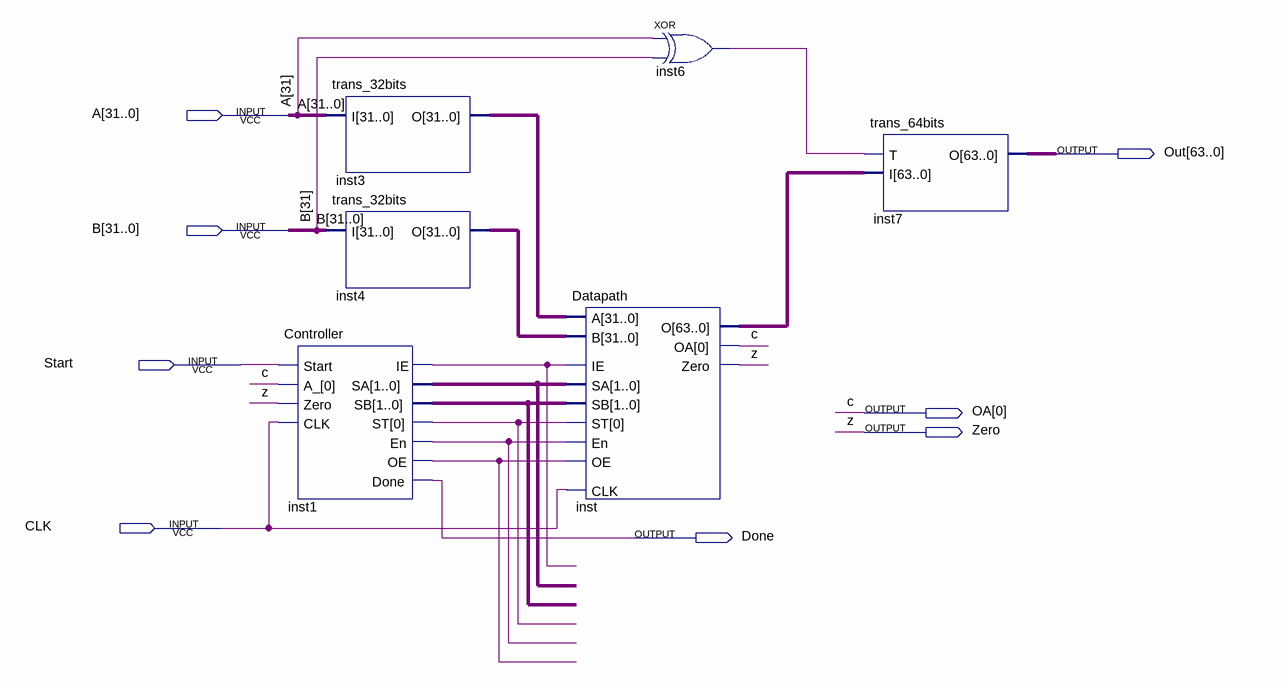
[diagram p0: schematic sheet]
// Quartus schematic test1.bdf as structural Verilog: 6 symbols, 8 pins
module test1 (
  input  [31:0] A,
  input  [31:0] B,
  input  Start,
  input  CLK,
  output [63:0] Out,
  output [0:0] OA,
  output Zero,
  output Done
);

  wire inst1_en, inst1_ie, inst1_oe, inst1_st, inst6_out;
  wire [1:0] inst1_sa, inst1_sb;
  wire [31:0] inst3_o, inst4_o;
  wire [63:0] inst_o;

  Controller inst1 (
    .Start(Start), .A_(OA[0]), .Zero(Zero), .CLK(CLK), .IE(inst1_ie), .SA(inst1_sa), .SB(inst1_sb),
    .ST(inst1_st), .En(inst1_en), .OE(inst1_oe), .Done(Done));
  trans_32bits inst3 (.I(A), .O(inst3_o));
  trans_32bits inst4 (.I(B), .O(inst4_o));
  Datapath inst (
    .ST(inst1_st), .OE(inst1_oe), .IE(inst1_ie), .SA(inst1_sa), .A(inst3_o), .SB(inst1_sb), .B(inst4_o),
    .CLK(CLK), .En(inst1_en), .O(inst_o), .OA(OA[0]), .Zero(Zero));
  xor inst6 (inst6_out, A[31], B[31]);
  trans_64bits inst7 (.T(inst6_out), .I(inst_o), .O(Out));

  // Other names for the same wires on the sheet: c = OA[0]; z = Zero
endmodule
